# EAGLE design MiiChrono (EAGLE 7.7.0)

## Sheet 1 of 2
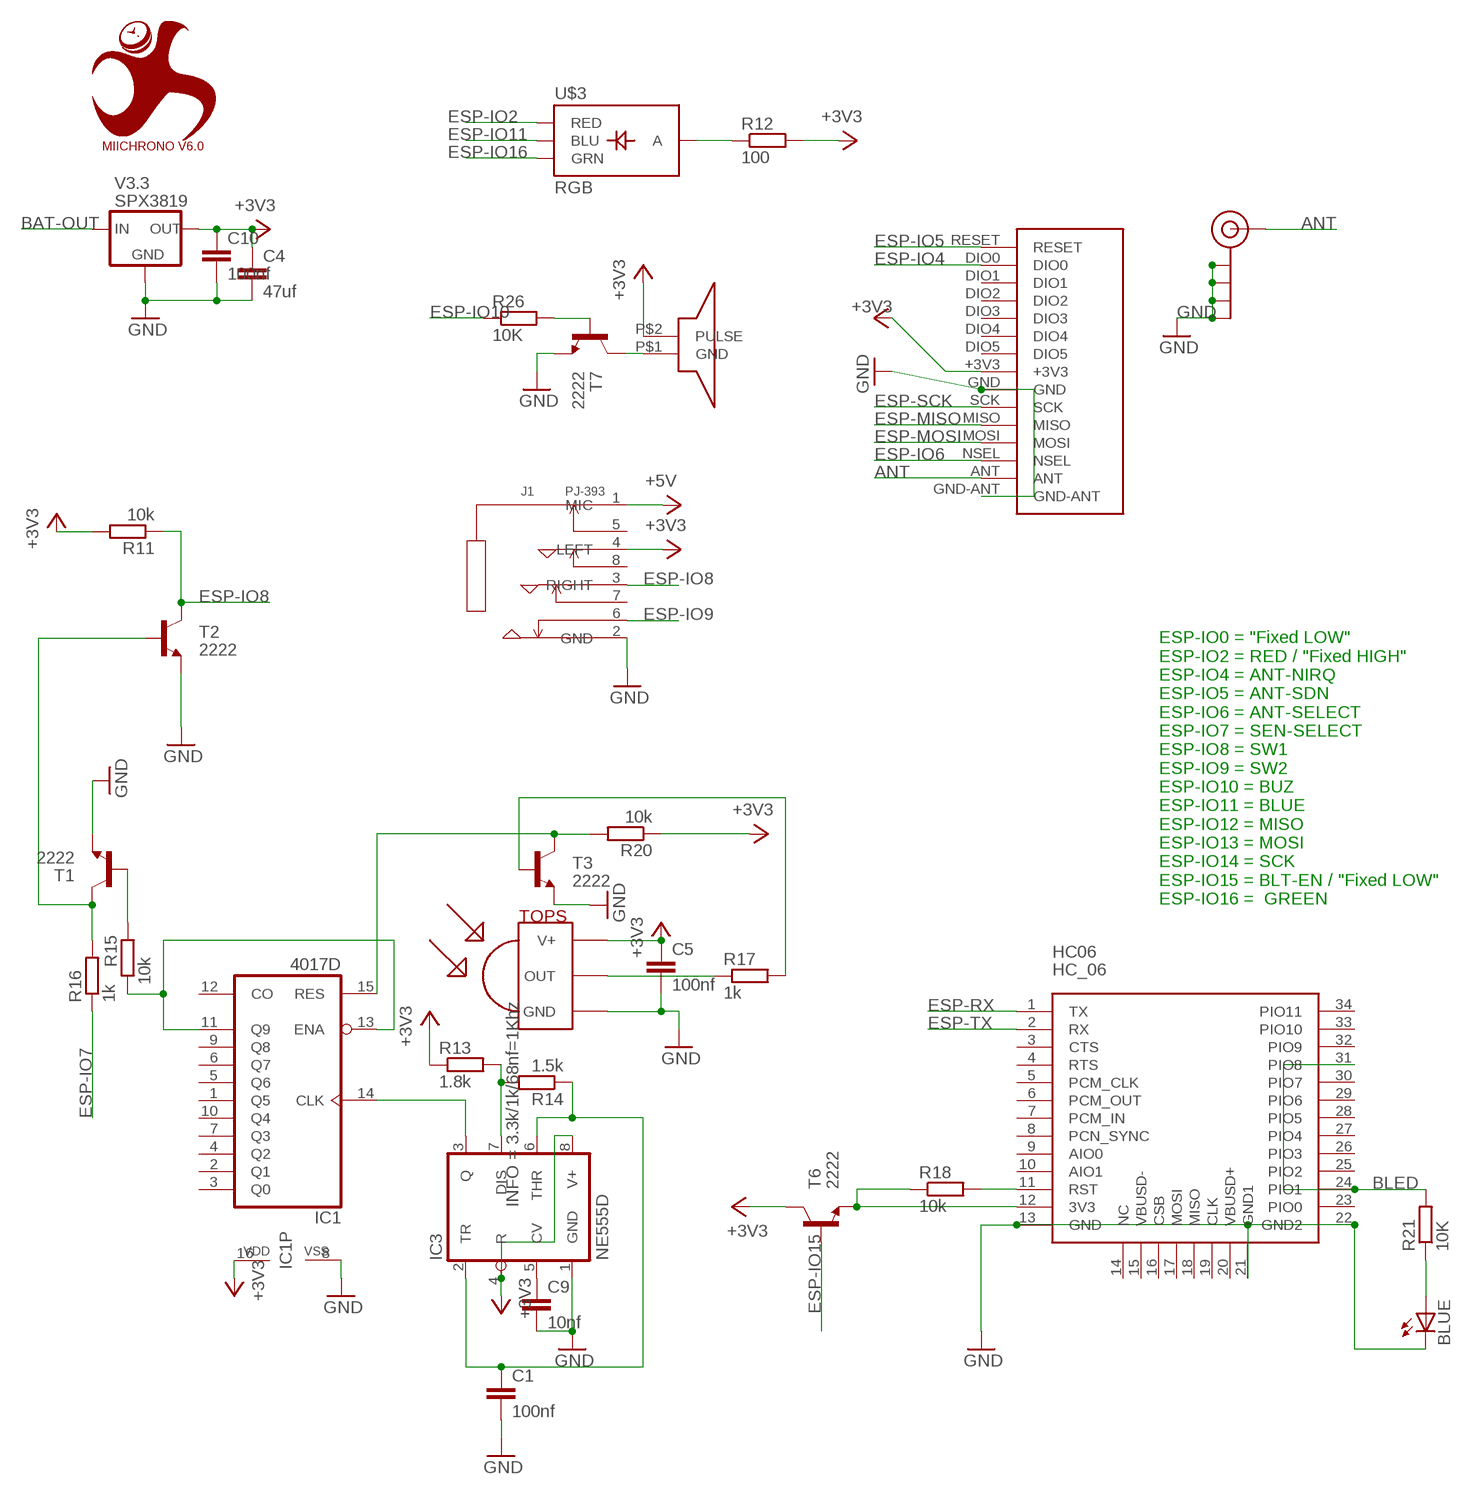
[diagram p0: schematic, sheet 1]

### Parts
BLUE  LEDCHIP-LED0805  [CHIP-LED0805]
BUZZER  BUZZER  [BUZZER]
C1  100nf  C-EUC0805  [C0805]
C4  47uf  C-EUC0805  [C0805]
C5  100nf  C-EUC0805  [C0805]
C9  10nf  C-EUC0805  [C0805]
C10  100nf  C-EUC0805  [C0805]
HC06  HC_06  HC_05  [BLUETOOTH_SMD]
IC1  4017D  [SO16]
IC3  NE555D  [SO08]
J1  PJ-393  AUDIO-JACK-PJ-393(8P-SMD)  [AUDIO8P-SMD-3.5-14.5X6.1X4.0MM]
J$1  SMA_EDGE  [SMA-EDGE]
R11  10k  R-EU_R0805  [R0805]
R12  100  R-EU_R0805  [R0805]
R13  1.8k  R-EU_R0805  [R0805]
R14  1.5k  R-EU_R0805  [R0805]
R15  10k  R-EU_R0805  [R0805]
R16  1k  R-EU_R0805  [R0805]
R17  1k  R-EU_R0805  [R0805]
R18  10k  R-EU_R0805  [R0805]
R20  10k  R-EU_R0805  [R0805]
R21  10K  R-EU_R0805  [R0805]
R26  10K  R-EU_R0805  [R0805]
T1  2222  TRANSISTOR_NPNSOT23  [SOT23]
T2  2222  TRANSISTOR_NPNSOT23  [SOT23]
T3  2222  TRANSISTOR_NPNSOT23  [SOT23]
T6  2222  TRANSISTOR_NPNSOT23  [SOT23]
T7  2222  TRANSISTOR_NPNSOT23  [SOT23]
TOPS  TSOP4838  [TSOP18XX]
U$1  MIICHRONO V6.0  MIICHRONO  [MIICHRONO]
U$2  DRF1278F  [DRF1278F]
U$3  RGB  LED-TRICOLOR  [LED-TRICOLOR-SMD]
V3.3  SPX3819  [SOT23-5]

### Nets
+3V3 [supply]: BUZZER.P$2(PULSE) C4.1 C5.1 C10.1 IC1.16(VDD) IC3.4(R) IC3.8(V+) J1.4(LEFT) R11.2 R12.2 R13.1 R20.1 T6.3(C) TOPS.VCC(V+) U$2.+3V3 V3.3.5(OUT)
+5V [supply]: J1.1(MIC) ; also sheet 2
ANT [antenna]: J$1.$P1(SIGNAL) U$2.ANT
BAT-OUT [supply]: V3.3.1(IN) V3.3.3(IN) ; also sheet 2
BLED: HC06.24(PIO1) HC06.31(PIO8) R21.2
ESP-IO2: U$3.R(RED) ; also sheet 2
ESP-IO4: U$2.DIO0 ; also sheet 2
ESP-IO5: U$2.RESET ; also sheet 2
ESP-IO6: U$2.NSEL ; also sheet 2
ESP-IO7: R16.1 ; also sheet 2
ESP-IO8: J1.3(RIGHT) R11.1 T2.3(C) ; also sheet 2
ESP-IO9: J1.6 ; also sheet 2
ESP-IO10: R26.1 ; also sheet 2
ESP-IO11: U$3.B(BLU) ; also sheet 2
ESP-IO15: T6.1(B) ; also sheet 2
ESP-IO16: U$3.G(GRN) ; also sheet 2
ESP-MISO: U$2.MISO ; also sheet 2
ESP-MOSI: U$2.MOSI ; also sheet 2
ESP-RX: HC06.1(TX) ; also sheet 2
ESP-SCK: U$2.SCK ; also sheet 2
ESP-TX: HC06.2(RX) ; also sheet 2
GND [supply]: BLUE.C C1.2 C4.2 C5.2 C9.2 C10.2 HC06.13(GND) HC06.21(GND1) HC06.22(GND2) IC1.8(VSS) IC3.1(GND) J1.2(GND) J$1.GND@0(GND) J$1.GND@1(GND) J$1.GND@2(GND) J$1.GND@3(GND) T1.2(E) T2.2(E) T3.2(E) T7.2(E) TOPS.GND U$2.GND U$2.GND-ANT V3.3.2(GND) ; also sheet 2
N$1: R17.2 T3.1(B)
N$2: C9.1 IC3.5(CV)
N$4: R16.2 T1.3(C) T2.1(B)
N$5: IC1.11(Q9) IC1.13(ENA) R15.1
N$7 [supply]: HC06.12(3V3) R18.1 T6.2(E)
N$10: R15.2 T1.1(B)
N$13: R12.1 U$3.A
N$14: C1.1 IC3.2(TR) IC3.6(THR) R14.1
N$15: HC06.11(RST) R18.2
N$16: IC1.14(CLK) IC3.3(Q)
N$17: IC3.7(DIS) R13.2 R14.2
N$20: R17.1 TOPS.OUT
N$22: BLUE.A R21.1
N$23: IC1.15(RES) R20.2 T3.3(C)
N$33: R26.2 T7.1(B)
N$34: BUZZER.P$1(GND) T7.3(C)
Unconnected: HC06.3(CTS) HC06.4(RTS) HC06.5(PCM_CLK) HC06.6(PCM_OUT) HC06.7(PCM_IN) HC06.8(PCN_SYNC) HC06.9(AIO0) HC06.10(AIO1) HC06.14(NC) HC06.15(VBUSD-) HC06.16(CSB) HC06.17(MOSI) HC06.18(MISO) HC06.19(CLK) HC06.20(VBUSD+) HC06.23(PIO0) HC06.25(PIO2) HC06.26(PIO3) HC06.27(PIO4) HC06.28(PIO5) HC06.29(PIO6) HC06.30(PIO7) HC06.32(PIO9) HC06.33(PIO10) HC06.34(PIO11) IC1.1(Q5) IC1.2(Q1) IC1.3(Q0) IC1.4(Q2) IC1.5(Q6) IC1.6(Q7) IC1.7(Q3) IC1.9(Q8) IC1.10(Q4) IC1.12(CO) J1.5 J1.7 J1.8 U$2.DIO1 U$2.DIO2 U$2.DIO3 U$2.DIO4 U$2.DIO5

### Notes on the sheet
- ESP-IO0 = "Fixed LOW"
  ESP-IO2 = RED / "Fixed HIGH"
  ESP-IO4 = ANT-NIRQ
  ESP-IO5 = ANT-SDN
  ESP-IO6 = ANT-SELECT
  ESP-IO7 = SEN-SELECT
  ESP-IO8 = SW1
  ESP-IO9 = SW2
  ESP-IO10 = BUZ
  ESP-IO11 = BLUE
  ESP-IO12 = MISO
  ESP-IO13 = MOSI
  ESP-IO14 = SCK
  ESP-IO15 = BLT-EN / "Fixed LOW"
  ESP-IO16 =  GREEN

## Sheet 2 of 2: ESP - 8285
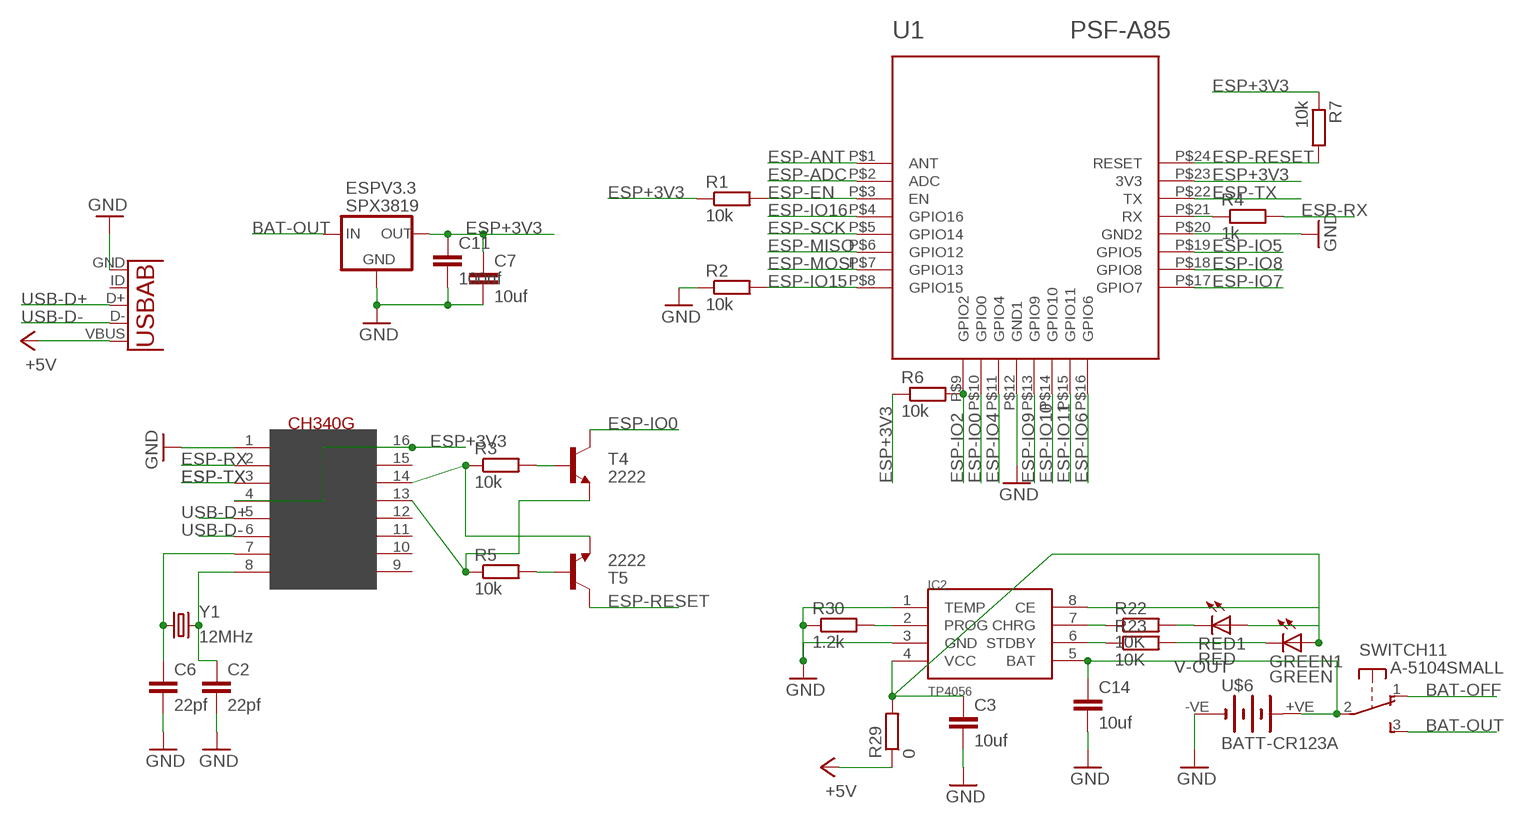
[diagram p1: schematic, sheet 2]

### Parts
C2  22pf  C-EUC0805  [C0805]
C3  10uf  C-EUC0805  [C0805]
C6  22pf  C-EUC0805  [C0805]
C7  10uf  C-EUC0805  [C0805]
C11  100nf  C-EUC0805  [C0805]
C14  10uf  C-EUC0805  [C0805]
ESPV3.3  SPX3819  [SOT23-5]
GREEN1  GREEN  LEDCHIP-LED0805  [CHIP-LED0805]
IC2  TP4056  [SOP-8]
ISP2  USB-ABUSB_SIERK  [USB_AB_MICRO_SJH]
R1  10k  R-EU_R0805  [R0805]
R2  10k  R-EU_R0805  [R0805]
R3  10k  R-EU_R0805  [R0805]
R4  1k  R-EU_R0805  [R0805]
R5  10k  R-EU_R0805  [R0805]
R6  10k  R-EU_R0805  [R0805]
R7  10k  R-EU_R0805  [R0805]
R22  10K  R-EU_R0805  [R0805]
R23  10K  R-EU_R0805  [R0805]
R29  0  R-EU_R0805  [R0805]
R30  1.2k  R-EU_R0805  [R0805]
RED1  RED  LEDCHIP-LED0805  [CHIP-LED0805]
SWITCH1  A-5104SMALL  [A-5104-SMALL]
T4  2222  TRANSISTOR_NPNSOT23  [SOT23]
T5  2222  TRANSISTOR_NPNSOT23  [SOT23]
U1  PSF-A85  [PSF-A85]
U$5  CH340G  [SOIC16]
U$6  BATT-CR123A  [KEYSTONE-2/3A]
Y1  12MHz  CRYSTAL5X3  [CRYSTAL-SMD-5X3]

### Nets
+5V [supply]: ISP2.VBUS R29.1 ; also sheet 1
BAT-OFF [supply]: SWITCH1.1(1:O)
BAT-OUT [supply]: ESPV3.3.1(IN) ESPV3.3.3(IN) SWITCH1.3(1:S) ; also sheet 1
ESP+3V3 [supply]: C7.1 C11.1 ESPV3.3.5(OUT) R1.1 R6.1 R7.1 U1.P$23(3V3) U$5.4(V3) U$5.16(VCC)
ESP-ADC: U1.P$2(ADC)
ESP-ANT: U1.P$1(ANT)
ESP-EN: R1.2 U1.P$3(EN)
ESP-IO0: T4.3(C) U1.P$10(GPIO0)
ESP-IO2: R6.2 U1.P$9(GPIO2) ; also sheet 1
ESP-IO4: U1.P$11(GPIO4) ; also sheet 1
ESP-IO5: U1.P$19(GPIO5) ; also sheet 1
ESP-IO6: U1.P$16(GPIO6) ; also sheet 1
ESP-IO7: U1.P$17(GPIO7) ; also sheet 1
ESP-IO8: U1.P$18(GPIO8) ; also sheet 1
ESP-IO9: U1.P$13(GPIO9) ; also sheet 1
ESP-IO10: U1.P$14(GPIO10) ; also sheet 1
ESP-IO11: U1.P$15(GPIO11) ; also sheet 1
ESP-IO15: R2.2 U1.P$8(GPIO15) ; also sheet 1
ESP-IO16: U1.P$4(GPIO16) ; also sheet 1
ESP-MISO: U1.P$6(GPIO12) ; also sheet 1
ESP-MOSI: U1.P$7(GPIO13) ; also sheet 1
ESP-RESET: R7.2 T5.3(C) U1.P$24(RESET)
ESP-RX: R4.2 U$5.2(TX) ; also sheet 1
ESP-SCK: U1.P$5(GPIO14) ; also sheet 1
ESP-TX: U1.P$22(TX) U$5.3(RX) ; also sheet 1
GND [supply]: C2.2 C3.2 C6.2 C7.2 C11.2 C14.2 ESPV3.3.2(GND) IC2.1(TEMP) IC2.3(GND) ISP2.GND R2.1 R30.1 U1.P$12(GND1) U1.P$20(GND2) U$5.1(GND) U$6.-VE(-) ; also sheet 1
N$3: C6.1 U$5.7(XI) Y1.1
N$6: C2.1 U$5.8(XO) Y1.3
N$8: R3.1 T5.2(E) U$5.14(RTS)
N$9: R5.1 T4.2(E) U$5.13(DTR)
N$24: R5.2 T5.1(B)
N$25: R3.2 T4.1(B)
N$26: R4.1 U1.P$21(RX)
N$27: GREEN1.C R23.2
N$28: R22.2 RED1.C
N$29: IC2.7(CHRG) R22.1
N$30: IC2.6(STDBY) R23.1
N$31: IC2.2(PROG) R30.2
USB-D+: ISP2.D+ U$5.5(D+)
USB-D-: ISP2.D- U$5.6(D-)
V-IN: C3.1 GREEN1.A IC2.4(VCC) IC2.8(CE) R29.2 RED1.A
V-OUT: C14.1 IC2.5(BAT) SWITCH1.2(1:P) U$6.+VE(+)
Unconnected: ISP2.ID(USBID) SWITCH1.MT1(MT) SWITCH1.MT2(MT) U$5.9(CTS) U$5.10(DSR) U$5.11(RI) U$5.12(DCD) U$5.15(RS232)

## Library data of the parts
BLUE GREEN1 RED1 = adafruit:LED: LED OSRAM: - CHIPLED LG R971, LG N971, LY N971, LG Q971, LY Q971, LO R971, LY R971 LH N974, LH R974 LS Q976, LO Q976, LY Q976 LO Q996 - Hyper CHIPLED LW Q18S LB Q993, LB Q99A, LB R99A - SideLED LS A670, LO A670, LY A670, LG A670, LP A670 LB A673, LV A673, LT A673, LW A673 LH A674 LY A675 LS A676, LA A676, LO A676, LY A676, LW A676 LS A679, LY A679, LG A679 - Hyper Micro SIDELED® LS Y876, LA Y876, LO Y876, LY Y876 LT Y87S - SmartLED LW L88C, LW L88S LB L89C, LB L89S, LG L890 LS L89K, LO L89K, LY L89K LS L896, LA L896, LO L896, LY L896 - TOPLED LS T670, LO T670, LY T670, LG T670, LP T670 LSG T670, LSP T670, LSY T670, LOP T670, LYG T670 LG T671, LOG T671, LSG T671 LB T673, LV T673, LT T673, LW T673 LH T674 LS T676, LA T676, LO T676, LY T676, LB T676, LH T676, LSB T676, LW T676 LB T67C, LV T67C, LT T67C, LS T67K, LO T67K, LY T67K, LW E67C LS E67B, LA E67B, LO E67B, LY E67B, LB E67C, LV E67C, LT E67C LW T67C LS T679, LY T679, LG T679 LS T770, LO T770, LY T770, LG T770, LP T770 LB T773, LV T773, LT T773, LW T773 LH T774 LS E675, LA E675, LY E675, LS T675 LS T776, LA T776, LO T776, LY T776, LB T776 LHGB T686 LT T68C, LB T68C - Hyper Mini TOPLED® LB M676 - Mini TOPLED Santana® LG M470 LS M47K, LO M47K, LY M47K Source: http://www.osram.convergy.de/
BUZZER = MyLib:BUZZER
C1-C7 C9-C11 C14 = rcl:C-EU: CAPACITOR, European symbol
ESPV3.3 V3.3 = PMIC:SPX3819
HC06 = SerialPortBluetooth:HC_05
IC1 = 40xx:4017: COUNTER/DIVIDER
IC2 = TP4056:TP4056
IC3 = adafruit:*555: TIMER Changed DIP package to have round (not oval) pin pads http://www.ladyada.net/library/pcb/eaglelibrary.html; INFO: 3.3k/1k/68nf=1Khz
ISP2 = MyLib:USB-AB: This is a USB AB connector that is compatible with USB OTG. i.e. this connector can serve as a host or device
J1 = MyLib:AUDIO-JACK-PJ-393(8P-SMD): 320040009; MPN: PJ-393
J$1 = MyLib:SMA_EDGE: SMA Antenna Connector End launch SMA connector. The paste layer has been removed so that the connector can be hand soldered onto the board after reflow.
R1-R7 R12 = rcl:R-EU_: RESISTOR, European symbol; NOTE: WAS 68
R11 R13-R18 R20 = rcl:R-EU_: RESISTOR, European symbol
R21-R23 R26 R29 R30 = rcl:R-EU_: RESISTOR, European symbol; NOTE: WAS 120
SWITCH1 = MyLib:A-5104: E-Switch right-angle slide SPDT Ebay and taydaElectronics A-5014
T1-T7 = SparkFun:TRANSISTOR_NPN: Transistor NPN BJT configuration in SOT23 package. MMBT2222 is the common NPN we use. Double check BCE configuration again layout.
TOPS = tsop:TSOP4838: IR Receiver and Demodulator
U1 = ITEAD:PSF-A85
U$1 = MyLib:MIICHRONO
U$2 = MyLib:DRF1278F
U$3 = MyLib:LED-TRICOLOR: Tri-Color LED SMD Proven layout and schematic for triple color LED in SMD package - common anode. Spark Fun Electronics SKU : COM-07844
U$5 = usb-serial:CH340G
U$6 = eagle-library-edeca:BATT-CR123A: CR123A (2/3rd AA) battery holder Manufacturer: Keystone Mouser part: 534-1019
Y1 = SparkFun:CRYSTAL: Crystals Various standard crystals. Proven footprints. Spark Fun Electronics SKU : COM-00534

## Net classes
0 default: width 0.203 mm
1 supply: width 0.254 mm
2 antenna: width 0.381 mm, clearance 0.203 mm

## Board
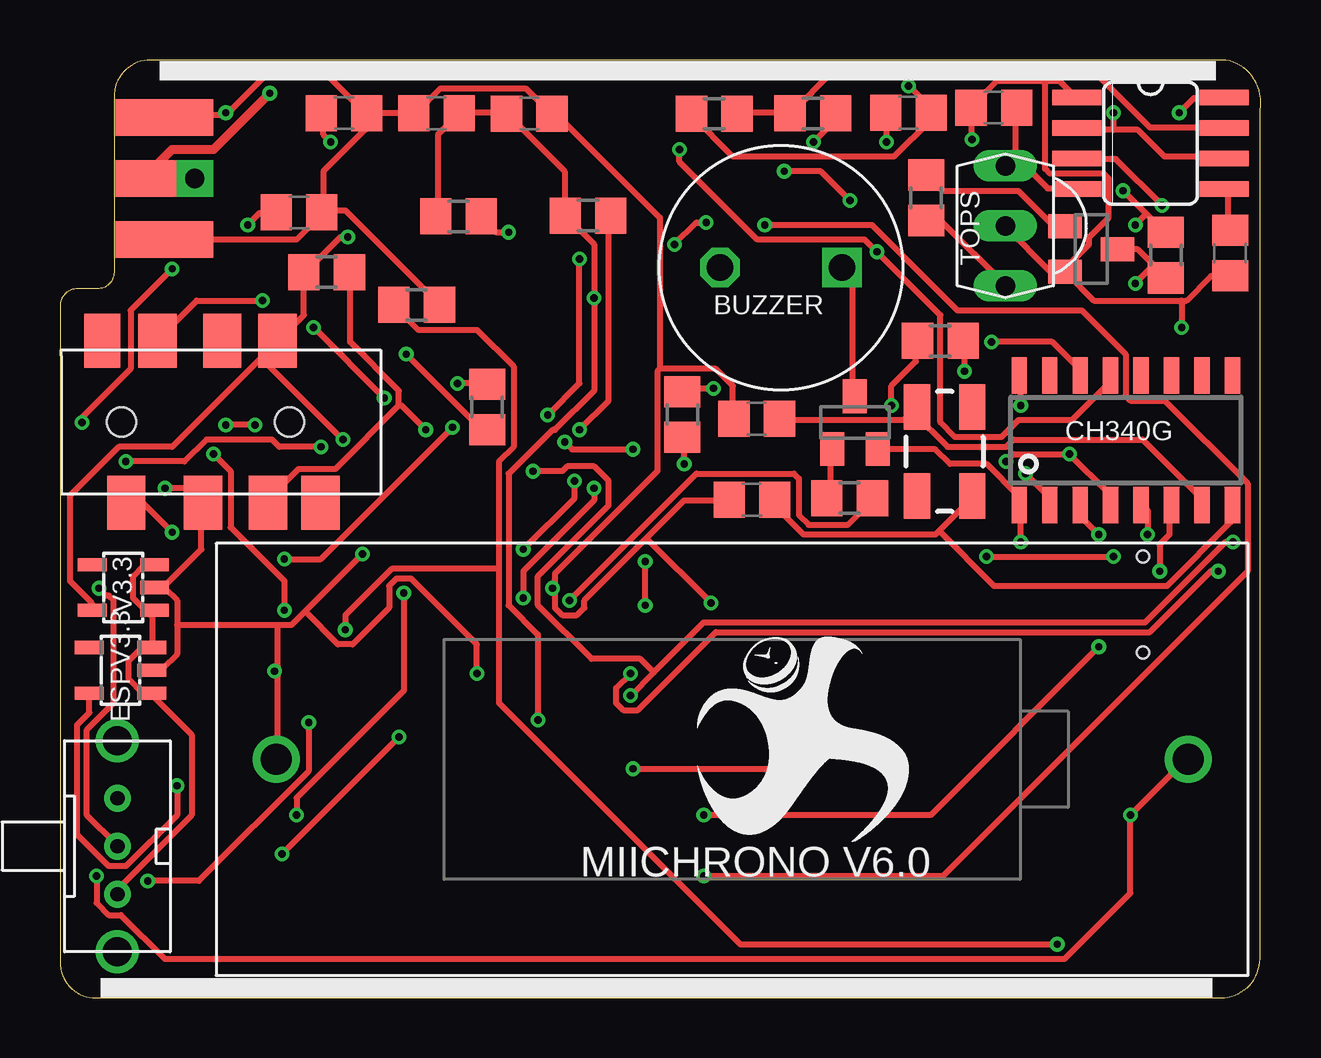
[diagram p2: board, top side]
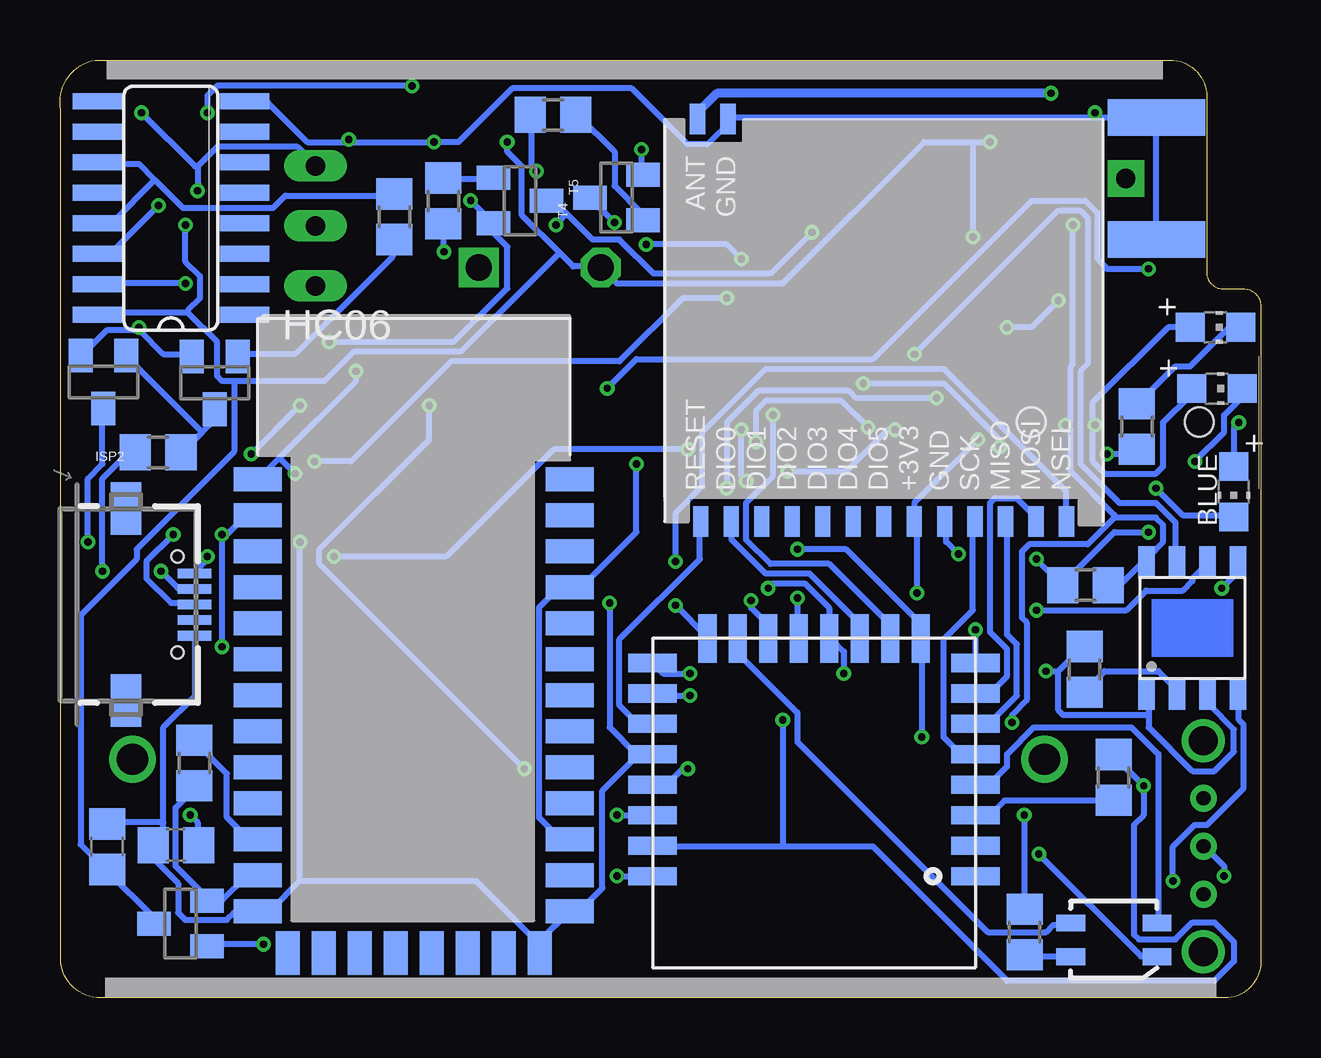
[diagram p3: board, bottom side, seen from below]

Size 50.03 x 39.08 mm. Coordinates in mm from the lower left corner, seen from the top.
Outline: 1.5,0 48.35,0 arc90 50,1.65 50,37 arc90 48.57,39.08 3.78,39.08 arc90 2.25,37.55 2.25,30.22 arc-90 1.58,29.55 0.72,29.55 arc90 0,28.82 0,1.5 arc90 1.5,0
Copper layers (1*16): Top 0.035mm / dielectric 1.5mm / Bottom 0.035mm
Design rules "SierkSeed *": minimum track width 10mil, minimum drill 12mil, track to track 6mil, track to pad 6mil, pad to pad 6mil, via to via 6mil, smd to smd 0mil, copper to edge 10mil, drill to drill 10mil, minimum pad ring 10mil, minimum via ring 6mil, stop-mask expansion 2mil, vias tented up to drill 100mil, thermal gap 10mil

### Footprints (pad centres in the part's own frame; a part is rotated, then mirrored left to right if it is on the bottom)
CHIP-LED0805 = smd 1.2 x 1.2: A 0,-1.05; C 0,1.05
BUZZER = drill 1.1 square: P$1 0,0 | drill 1.1 octagon: P$2 5.08,0
C0805 = smd 1.3 x 1.5: 1 -0.95,0; 2 0.95,0
SOT23-5 = smd 1.2 x 0.55: 1 1.3,-0.95; 2 1.3,0; 3 1.3,0.95; 4 -1.3,0.95; 5 -1.3,-0.95
BLUETOOTH_SMD = smd 2 x 1: 1 0,0; 2 0,-1.5; 3 0,-3; 4 0,-4.5; 5 0,-6; 6 0,-7.5; 7 0,-9; 8 0,-10.5; 9 0,-12; 10 0,-13.5; 11 0,-15; 12 0,-16.5; 13 0,-18; 22 13,-18; 23 13,-16.5; 24 13,-15; 25 13,-13.5; 26 13,-12; 27 13,-10.5; 28 13,-9; 29 13,-7.5; 30 13,-6; 31 13,-4.5; 32 13,-3; 33 13,-1.5; 34 13,0 | smd 1 x 1.8: 14 1.25,-19.75; 15 2.75,-19.75; 16 4.25,-19.75; 17 5.75,-19.75; 18 7.25,-19.75; 19 8.75,-19.75; 20 10.25,-19.75; 21 11.75,-19.75
SO16 = smd 0.66 x 2.032: 1 -4.445,-3.073; 2 -3.175,-3.073; 3 -1.905,-3.073; 4 -0.635,-3.073; 5 0.635,-3.073; 6 1.905,-3.073; 7 3.175,-3.073; 8 4.445,-3.073; 9 4.445,3.073; 10 3.175,3.073; 11 1.905,3.073; 12 0.635,3.073; 13 -0.635,3.073; 14 -1.905,3.073; 15 -3.175,3.073; 16 -4.445,3.073
SOP-8 = smd 1.3 x 0.7: 1 -2.75,1.905; 2 -2.75,0.635; 3 -2.75,-0.635; 4 -2.75,-1.905; 5 2.75,-1.905; 6 2.75,-0.635; 7 2.75,0.635; 8 2.75,1.905
SO08 = smd 0.66 x 2.032: 1 -1.905,-3.073; 2 -0.635,-3.073; 3 0.635,-3.073; 4 1.905,-3.073; 5 1.905,3.073; 6 0.635,3.073; 7 -0.635,3.073; 8 -1.905,3.073
USB_AB_MICRO_SJH = smd 1.4 x 0.4: D+ 2.85,0; D- 2.85,0.65; GND 2.85,-1.3; ID 2.85,-0.65; VBUS 2.85,1.3 | smd 1.27 x 2.2: P$8 0,4; P$9 0,-4 | hole 0.5: 2.15,2; 2.15,-2
AUDIO8P-SMD-3.5-14.5X6.1X4.0MM = smd 1.6 x 2.25: 1 3.9,-3.375; 2 7.1,-3.375; 3 9.8,-3.375; 4 10.2,3.375; 6 5.2,3.375; 7 7.9,3.375; 8 12,-3.375 | smd 1.5 x 2.25: 5 2.9,3.375 | hole 1.2: 3.7,0; 10.7,0
SMA-EDGE = smd 1.524 x 2.54: $P1 2.54,0.762 | smd 1.524 x 4.064: GND@0 0,0; GND@1 5.08,0 | smd 1.524 x 4.064 bottom: GND@2 0,0; GND@3 5.08,0 | drill 0.8 pad 1.524 square: SIG 2.54,-1.27
R0805 = smd 1.3 x 1.5: 1 -0.95,0; 2 0.95,0
A-5104-SMALL = drill 0.6: 1 -2,0; 2 0,0; 3 2,0 | drill 1.2: MT1 -4.4,0; MT2 4.4,0
SOT23 = smd 1 x 1.4: 1 -0.95,-1.1; 2 0.95,-1.1; 3 0,1.1
TSOP18XX = drill 0.813 long: GND -0.001,-0.027; OUT -2.501,-0.027; VCC 2.499,-0.027
PSF-A85 = smd 0.762 x 2.032: P$1 3.81,0; P$2 5.08,0; P$3 6.35,0; P$4 7.62,0; P$5 8.89,0; P$6 10.16,0; P$7 11.43,0; P$8 12.7,0; P$17 12.7,13.462; P$18 11.43,13.462; P$19 10.16,13.462; P$20 8.89,13.462; P$21 7.62,13.462; P$22 6.35,13.462; P$23 5.08,13.462; P$24 3.81,13.462 | smd 2.032 x 0.762: P$9 13.716,2.286; P$10 13.716,3.556; P$11 13.716,4.826; P$12 13.716,6.096; P$13 13.716,7.366; P$14 13.716,8.636; P$15 13.716,9.906; P$16 13.716,11.176
DRF1278F = smd 0.635 x 1.27: +3V3 0.24,-7.62; ANT -8.79,9.144; DIO0 -7.38,-7.62; DIO1 -6.11,-7.62; DIO2 -4.84,-7.62; DIO3 -3.57,-7.62; DIO4 -2.3,-7.62; DIO5 -1.03,-7.62; GND 1.51,-7.62; GND-ANT -7.52,9.144; MISO 4.05,-7.62; MOSI 5.32,-7.62; NSEL 6.59,-7.62; RESET -8.65,-7.62; SCK 2.78,-7.62
LED-TRICOLOR-SMD = smd 0.7 x 1.2: A 0.7,-1.8; B -0.7,-1.8; G -0.7,1.8; R 0.7,1.8
SOIC16 = smd 0.635 x 1.524: 1 -4.445,-2.695; 2 -3.175,-2.695; 3 -1.905,-2.695; 4 -0.635,-2.695; 5 0.635,-2.695; 6 1.905,-2.695; 7 3.175,-2.695; 8 4.445,-2.695; 9 4.445,2.695; 10 3.175,2.695; 11 1.905,2.695; 12 0.635,2.695; 13 -0.635,2.695; 14 -1.905,2.695; 15 -3.175,2.695; 16 -4.445,2.695
KEYSTONE-2/3A = drill 1.3: +VE 0,19; -VE 0,-19
CRYSTAL-SMD-5X3 = smd 1.9 x 1.1: 1 -1.85,-1.15; 2 1.85,-1.15; 3 1.85,1.15; 4 -1.85,1.15

### Placement (x,y rotation side)
BLUE  1.12,21.09 180 bottom
BUZZER  32.58,30.43 180 top
C1  35.35,36.88 180 top
C2  28.83,20.76 180 top
C3  9.96,32.73 0 top
C4  48.07,6.3 90 bottom
C5  38.91,37.1 180 top
C6  29.03,24.13 180 top
C7  19.55,36.85 0 top
C9  48.75,31.04 270 top
C10  11.83,36.87 0 top
C11  15.69,36.86 180 top
C14  45.2,6.37 180 bottom
ESPV3.3  2.52,13.65 0 top
GREEN1  1.88,27.94 270 bottom
HC06  41.78,21.62 0 bottom
IC1  45.41,32.91 90 bottom
IC2  2.85,15.41 90 bottom
IC3  45.44,35.61 270 top
ISP2  47.28,16.39 0 bottom
J1  -1.14,24 0 top
J$1  4.35,31.6 90 top
R1  6.13,9.19 270 bottom
R2  14.86,28.88 180 top
R3  29.49,36.79 0 bottom
R4  36.68,27.38 0 top
R5  34.06,33.21 90 bottom
R6  22,32.6 0 top
R7  16.6,32.56 0 top
R11  11.11,30.24 180 top
R12  9.84,2.75 90 bottom
R13  31.37,36.86 180 top
R14  27.26,36.84 0 top
R15  36.1,32.55 270 bottom
R16  45.94,22.73 0 bottom
R17  36.09,33.34 90 top
R18  44.43,9.79 90 bottom
R20  46.08,30.95 270 top
R21  25.93,24.31 270 top
R22  17.8,24.62 90 top
R23  5.16,23.81 90 bottom
R26  32.9,20.82 180 top
R29  7.3,17.2 0 bottom
R30  7.34,13.69 270 bottom
RED1  1.82,25.39 270 bottom
SWITCH1  2.39,6.32 270 top
T1  43.58,25.63 180 bottom
T2  48.22,25.66 180 bottom
T3  42.97,31.2 270 top
T4  26.84,33.35 90 bottom
T5  30.86,33.22 270 bottom
T6  45.01,3.1 90 bottom
T7  33.12,23.97 0 top
TOPS  39.36,32.17 90 top
U1  11.88,1.26 90 bottom
U$1  26.54,6.51 0 top
U$2  14.68,27.47 0 bottom
U$3  6.12,2.42 270 bottom
U$5  44.41,23.24 0 top
U$6  28.01,9.94 270 top
V3.3  2.64,17.1 0 top
Y1  36.86,22.77 270 top

### Tracks (layer width: path | path; a pad name or v marks a point on that pad's centre or on a via)
+3V3  (via drill 0.3)
  Top 0.254: V3.3.5 1.32,16.15 1.32,16.46 0.41,17.37 0.41,20.93 2.44,22.96 4.67,22.96 9.04,27.33 J1.4 | v11.79,23.27 8.43,26.62 J1.4 | v9.86,7.62 9.86,8.33 14.33,12.8 v14.33,16.87 | J1.4 9.14,27.43 10.16,28.45 R11.2 10.26,30.28 11.68,31.7 v11.99,31.7 | v44.3,33.63 45.26,32.66 | 45.26,32.66 46.02,31.9 R20.1 | C5.1 39.83,37.08 39.83,35.15 39.42,34.75 TOPS.VCC 39.83,35.05 41.15,33.73 42.27,33.73 IC3.4 | v46.63,36.88 47.24,37.49 48.46,37.49 IC3.8 | v31.39,35.66 32.31,36.58 32.31,36.78 R13.1 | v11.28,35.66 10.97,35.97 10.97,36.78 C10.1 | v44.81,32.21 45.26,32.66
  Bottom 0.254: v11.79,23.27 14.43,20.62 14.43,19.91 U$2.+3V3 14.33,19.81 v14.33,16.87 | v9.86,7.62 9.86,3.76 R12.2 | 44.3,34.65 v44.3,33.63 | 44.3,34.65 43.48,35.46 40.13,35.46 39.42,34.75 TOPS.VCC | v46.63,36.88 44.4,34.65 44.3,34.65 | T6.3 46.13,3.15 46.13,3.35 48.06,5.28 C4.1 48.16,5.38 49.17,6.4 49.17,15.95 46.84,18.29 46.84,18.69 42.77,22.76 42.77,25.7 | v31.39,35.66 31.39,35.26 30.79,34.65 30.79,32.61 29.21,31.04 | 29.21,31.04 28.65,30.48 27.53,30.48 BUZZER.P$2 27.43,30.38 26.82,29.77 19.91,29.77 14.02,35.66 11.99,35.66 | 11.99,35.66 v11.28,35.66 | 44.7,28.55 48.46,28.55 IC1.16 | 44.7,28.55 43.48,27.33 43.48,25.91 43.28,25.7 42.77,25.7 | 42.77,25.7 39.01,25.7 37.8,26.92 33.33,26.92 29.21,31.04 | v44.81,32.21 44.81,30.68 44.2,30.07 44.2,29.16 44.7,28.65 44.7,28.55 | 11.99,35.66 v11.99,31.7
+5V  (via drill 0.3)
  Top 0.254: v38.61,18.39 v43.89,18.39 | v23.88,22.86 21.34,22.86 v21.03,23.16 | v16.36,23.77 10.87,18.29 v9.35,18.29 | v4.67,19.41 3.45,20.62 2.85,20.62 J1.1
  Bottom 0.254: v43.89,18.39 43.89,18.29 44.4,17.78 ISP2.VBUS | v38.61,18.39 33.93,18.39 29.46,22.86 v23.88,22.86 | v21.03,23.16 21.03,24.49 20.62,24.89 17.48,24.89 v16.36,23.77 | v9.35,18.29 8.33,17.27 R29.1 8.23,17.27 6.1,19.41 v4.67,19.41
ANT  (via drill 0.3)
  Top 0.381: v8.74,37.69 6.4,35.36 4.67,35.36 3.56,34.24 J$1.$P1
  Bottom 0.381: v8.74,37.69 22.66,37.69 23.47,36.88 23.47,36.68 U$2.ANT
BAT-OUT
  Top 0.254: V3.3.3 3.86,17.98 3.45,17.98 3.05,17.58 3.05,16.66 3.76,15.95 V3.3.1 3.86,16.05 3.86,14.63 ESPV3.3.3 3.76,14.53 3.35,14.53 2.85,14.02 2.85,13.31 3.45,12.7 ESPV3.3.1 3.86,12.6 5.49,10.97 5.49,7.62 2.44,4.57 2.44,4.37 SWITCH1.3
BLED  (via drill 0.3)
  Top 0.254: v26.01,22.25 26.01,23.27 R21.2
  Bottom 0.254: v26.01,22.25 26.01,19.41 28.25,17.17 28.75,17.17 HC06.31 28.85,17.07 29.26,17.07 30.07,16.26 30.07,7.52 29.26,6.71 28.85,6.71 HC06.24
ESP+3V3  (via drill 0.3)
  Top 0.254: v4.88,8.84 4.88,7.62 2.74,5.49 2.03,5.49 0.71,6.81 0.71,11.38 1.22,11.89 ESPV3.3.5 | v40.03,24.69 40.03,25.91 U$5.16 | U$5.4 43.69,20.62 43.69,21.03 v42.06,22.66 39.73,22.66 v39.42,22.35 | R7.1 15.75,32.61 15.75,35.97 16.56,36.78 C11.1 16.76,36.88 18.49,36.88 C7.1 18.69,36.78 21.03,34.44 21.03,32.61 R6.1 21.13,32.51 22.25,31.39 v22.25,29.16 22.25,25.3 20.62,23.67 20.52,23.67 18.69,21.84 18.69,16.36 19.91,15.14 v19.91,11.58
  Bottom 0.254: R1.1 6.1,10.06 v4.88,8.84 4.88,7.62 5.28,7.21 5.28,2.64 5.08,2.44 3.56,2.44 2.85,3.15 1.93,3.15 1.12,2.34 1.12,1.52 1.93,0.71 10.57,0.71 16.15,6.3 19.91,6.3 | 19.91,6.3 25.3,6.3 U1.P$23 | v42.06,22.66 v40.03,24.69 | v39.42,22.35 37.9,22.35 33.73,26.52 26.72,26.52 24.08,29.16 v22.25,29.16 | v19.91,11.58 19.91,6.3
ESP-EN
  Bottom 0.254: R1.2 6.2,8.23 10.67,8.23 11.28,7.62 11.79,7.62 U1.P$3
ESP-IO0  (via drill 0.3)
  Top 0.254: v26.92,32.31 26.52,32.31 v25.6,31.39 | v21.64,30.79 21.64,25.6 v20.32,24.28
  Bottom 0.254: v26.92,32.31 27.94,33.33 T4.3 | v25.6,31.39 22.25,31.39 v21.64,30.79 | v20.32,24.28 20.32,21.74 21.44,20.62 21.44,19.1 20.42,18.09 17.98,18.09 15.44,15.54 15.44,15.04 U1.P$10
ESP-IO2  (via drill 0.3)
  Top 0.254: v14.12,10.87 v9.25,5.99 | v21.64,23.67 22.86,24.89 22.86,32.51 R6.2 | v21.44,21.54 21.44,20.83 v19.3,18.69
  Bottom 0.254: v9.25,5.99 4.98,1.73 4.37,1.73 U$3.R | v14.12,10.87 14.12,14.94 U1.P$9 14.22,15.04 14.22,15.65 17.27,18.69 v19.3,18.69 | v21.64,23.67 21.64,21.74 v21.44,21.54
ESP-IO4
  Bottom 0.254: U$2.DIO0 22.05,19.81 22.05,19.1 20.62,17.68 18.8,17.68 16.76,15.65 16.76,15.04 U1.P$11
ESP-IO5
  Bottom 0.254: U$2.RESET 23.37,19.81 23.37,18.29 26.72,14.94 26.72,12.19 26.01,11.48 25.4,11.48 U1.P$19
ESP-IO6  (via drill 0.3)
  Top 0.254: v24.38,16.36 v24.38,18.19
  Bottom 0.254: v24.38,18.19 24.38,20.22 23.27,21.34 23.27,23.57 20.62,26.21 13.21,26.21 8.13,21.13 8.13,19.91 U$2.NSEL | v24.38,16.36 23.06,15.04 U1.P$16
ESP-IO7  (via drill 0.3)
  Top 0.254: v48.26,17.78 47.95,17.78 45.41,15.24 27.33,15.24 24.08,11.99 23.47,11.99 23.16,12.29 23.16,12.9 v23.77,13.51
  Bottom 0.254: v48.26,17.78 48.26,21.64 47.24,22.66 46.94,22.66 R16.1 | v23.77,13.51 24.89,13.51 25.3,13.92 U1.P$17
ESP-IO8  (via drill 0.3)
  Top 0.254: 14.12,24.69 14.12,25.3 12.09,27.33 12.09,30.18 R11.1 | 14.12,24.69 11.48,22.05 9.96,22.05 8.64,20.73 J1.3 | v48.87,19 48.56,19 45.21,15.65 26.82,15.65 24.74,13.56 | v23.77,12.6 24.74,13.56 | v15.24,23.67 14.22,24.69 14.12,24.69 | v19.71,21.95 20.93,21.95 21.13,22.15 22.25,22.15 22.86,21.54 22.86,20.52 19.91,17.58 19.91,16.36 22.15,14.12 24.18,14.12 24.74,13.56
  Bottom 0.254: v48.87,19 48.87,21.64 48.26,22.25 48.26,24.49 T2.3 | v23.77,12.6 25.3,12.6 U1.P$18 | v15.24,23.67 15.54,23.67 17.27,21.95 v19.71,21.95
ESP-IO9  (via drill 0.3)
  Top 0.254: v19.3,16.66 19.3,17.78 22.25,20.73 v22.25,21.23 | v10.57,27.94 v13.51,24.99 | v8.43,29.06 5.69,29.06 4.06,27.43 J1.6
  Bottom 0.254: v19.3,16.66 19.3,15.04 U1.P$13 | v22.25,21.23 22.25,23.98 20.93,25.3 17.17,25.3 16.87,24.99 v13.51,24.99 | v10.57,27.94 9.55,27.94 v8.43,29.06
ESP-IO10  (via drill 0.3)
  Top 0.254: v21.23,16.56 26.52,21.84 30.58,21.84 30.79,21.64 30.79,20.12 31.19,19.71 32.82,19.71 33.83,20.73 R26.1
  Bottom 0.254: v21.23,16.56 21.23,16.26 20.52,15.54 20.52,15.04 U1.P$14
ESP-IO11
  Bottom 0.254: U$3.B 7.92,3.05 8.64,3.05 8.94,2.74 11.38,2.74 19.3,10.67 19.3,11.89 21.74,14.33 21.74,14.94 U1.P$15
ESP-IO15  (via drill 0.3)
  Top 0.254: v41.55,2.23 28.35,2.23 18.29,12.29 18.29,17.88 | 18.29,17.88 18.29,22.35 18.9,22.96 18.9,26.31 17.37,27.84 14.94,27.84 13.92,28.85 R2.2 | v11.89,15.34 11.89,15.95 13.82,17.88 18.29,17.88
  Bottom 0.254: v41.55,2.23 43.89,2.23 T6.1 | v11.89,15.34 11.89,14.02 U1.P$8
ESP-IO16
  Bottom 0.254: U$3.G 4.27,3.15 4.27,10.16 5.38,11.28 9.45,11.28 10.57,10.16 10.57,9.65 11.28,8.94 11.79,8.94 U1.P$4
ESP-MISO
  Bottom 0.254: U$2.MISO 10.57,19.81 10.57,15.14 10.16,14.73 10.16,12.6 11.28,11.48 11.79,11.48 U1.P$6
ESP-MOSI
  Bottom 0.254: U$2.MOSI 9.45,19.91 9.45,20.12 10.16,20.83 11.07,20.83 11.28,20.62 11.28,15.24 10.57,14.53 10.57,13.41 11.28,12.7 11.79,12.7 U1.P$7
ESP-RESET  (via drill 0.3)
  Top 0.254: v18.69,31.9 18.19,31.9 17.58,32.51 R7.2 | v26.82,5.08 36.78,5.08 49.48,17.78 49.48,21.44 46.02,24.89 44.6,24.89 44.4,25.09 44.4,26.82 42.57,28.65 37.39,28.65 33.83,32.21 v29.36,32.21
  Bottom 0.254: 28.91,32.66 27.84,31.6 26.72,31.6 25.3,30.18 20.42,30.18 v18.69,31.9 | 28.91,32.66 29.36,33.12 29.67,33.12 T5.3 | v26.82,5.08 25.4,5.08 U1.P$24 | 28.91,32.66 v29.36,32.21
ESP-RX  (via drill 0.3)
  Top 0.254: v37.69,26.11 37.69,27.33 R4.2 | v40.23,21.84 41.15,20.93 41.15,20.62 U$5.2
  Bottom 0.254: v37.69,26.11 37.69,25.7 40.89,22.5 | 40.89,22.5 41.76,21.64 HC06.1 | 40.89,22.5 v40.23,21.84
ESP-SCK
  Bottom 0.254: U$2.SCK 11.99,19.81 11.99,16.15 13.21,14.94 13.21,10.87 12.5,10.16 U1.P$5
ESP-TX  (via drill 0.3)
  Top 0.254: v43.28,19.3 42.57,20.02 42.57,20.52 U$5.3 | v26.82,7.62 36.27,7.62 v43.28,14.63
  Bottom 0.254: HC06.2 41.86,20.12 42.27,20.12 43.08,19.3 v43.28,19.3 v43.28,14.63 | v26.82,7.62 25.4,7.62 U1.P$22
GND  (via drill 0.3)
  Top 0.254: 41.05,38.2 41.66,38.2 42.27,37.59 IC3.1 | 41.05,38.2 39.01,38.2 38,37.19 C5.2 38,36.98 v38,35.76 | T3.2 41.86,30.28 41.25,30.28 39.42,32.11 TOPS.GND | 46.74,29.06 43.08,29.06 41.96,30.18 T3.2 | 46.74,29.06 46.94,29.06 47.95,30.07 48.67,30.07 C9.2 | 46.74,29.06 v46.74,27.94 | 41.05,38.2 41.05,34.54 41.25,34.34 43.48,34.34 43.69,34.14 43.69,32.51 42.88,31.7 42.88,31.39 41.86,30.38 T3.2 | v34.44,35.66 34.44,36.78 C1.2 | T7.2 34.14,22.86 36.47,22.86 37.08,22.25 38.61,22.25 39.93,20.93 39.93,20.62 U$5.1 40.03,20.52 v40.03,19 | v4.37,21.23 5.38,21.23 5.89,20.73 J1.2 5.89,20.52 5.89,18.69 4.37,17.17 V3.3.2 3.96,17.07 4.37,17.07 4.88,16.56 4.88,15.54 | 4.88,15.54 4.88,14.33 4.27,13.72 3.86,13.72 ESPV3.3.2 | 10.21,16.1 9.65,15.54 9.04,15.54 | 10.21,16.1 v12.6,18.49 | 4.88,15.54 9.04,15.54 | 9.04,15.54 9.04,13.61 | 9.04,13.61 9.04,9.96 U$6.-VE | v8.94,13.61 9.04,13.61 | 24.43,19.15 21.84,16.56 21.84,16.26 21.54,15.95 20.93,15.95 20.62,16.26 20.62,17.07 | 24.43,19.15 26.01,20.73 27.84,20.73 C2.2 | 20.62,17.07 20.62,17.68 24.89,21.95 24.89,26.11 24.99,26.21 | 24.99,26.21 27.33,26.21 28.04,25.5 28.04,24.18 C6.2 | v20.52,17.07 20.62,17.07 | C3.2 10.97,32.82 10.97,34.44 12.7,36.17 12.7,36.78 C10.2 | R2.1 15.75,28.96 11.89,32.82 11.07,32.82 C3.2 | C10.2 12.9,36.88 14.73,36.88 C11.2 14.83,36.88 15.85,37.9 19.41,37.9 20.42,36.88 C7.2 20.62,36.88 24.99,32.51 24.99,26.21 | J$1.GND@2 4.37,31.6 9.86,31.6 10.87,32.61 C3.2 | 6.91,36.78 4.37,36.78 J$1.GND@3 | 6.91,36.78 8.53,38.41 11.18,38.41 12.7,36.88 C10.2 | 10.21,16.1 11.58,14.73 12.19,14.73 13.72,16.26 13.72,17.17 14.02,17.48 14.63,17.48 17.37,14.73 v17.37,13.51
  Top 0.254: 24.43,19.15 v27.13,16.46 | v6.91,36.88 6.91,36.78
  Bottom 0.254: 46.74,27.84 45.72,26.82 44.6,26.82 T1.2 | 46.74,27.84 48.06,27.84 49.07,26.82 T2.2 | v46.74,27.94 46.74,27.84 | 38,35.66 39.73,35.66 41.35,37.29 42.27,37.29 IC1.8 | 38,35.66 v34.44,35.66 33.43,35.66 31.19,37.9 26.21,37.9 23.88,35.56 23.06,35.56 22.05,36.58 U$2.GND-ANT 22.15,36.68 6.91,36.68 | 6.91,36.68 4.37,36.68 J$1.GND@3 4.37,36.58 4.37,31.7 J$1.GND@2 | v38,35.76 38,35.66 | 45.72,7.32 45.72,6.81 46.13,6.4 C14.2 46.13,6.3 46.13,5.79 45.11,4.78 45.11,3.56 44.81,3.25 43.08,3.25 42.77,3.56 41.86,3.56 HC06.13 41.66,3.66 41.25,3.66 40.03,4.88 | 45.72,7.32 45.72,11.28 44.4,12.6 44.4,15.04 ISP2.GND | 45.72,7.32 48.06,7.32 C4.2 | 40.03,4.88 v40.03,19 | 40.03,4.88 32.72,4.88 30.28,2.44 30.07,2.44 HC06.21 29.97,1.93 29.97,2.44 28.85,3.56 HC06.22 28.65,3.66 28.35,3.66 27.43,4.57 27.43,8.64 26.01,10.06 25.4,10.06 U1.P$20 26.01,10.16 27.13,11.28 v27.13,16.46 | 4.67,11.79 4.67,12.6 IC2.1 | 4.67,11.79 4.67,11.28 2.85,9.45 1.93,9.45 1.12,10.26 1.12,11.18 2.13,12.19 2.13,12.6 IC2.3 | 8.43,13.61 7.42,14.63 R30.1 | 8.43,13.61 8.43,11.99 8.23,11.79 4.67,11.79 | v4.37,21.23 3.25,20.12 1.22,20.12 BLUE.C | v12.6,18.49 13.11,19 13.11,19.81 U$2.GND | v8.94,13.61 8.43,13.61 | v20.52,17.07 20.32,17.27 19,17.27 17.98,16.26 17.98,15.04 U1.P$12 17.88,14.94 17.37,14.43 v17.37,13.51 | v6.91,36.88 6.91,36.68
N$1
  Top 0.254: T3.1 41.86,32.21 41.35,32.21 39.93,33.63 36.78,33.63 36.17,34.24 R17.2
N$2
  Top 0.254: C9.1 48.67,32 48.67,33.53 48.56,33.63 IC3.5
N$3
  Top 0.254: C6.1 30.07,24.08 35.15,24.08 35.66,24.59 Y1.1 35.56,24.38 36.98,22.96 39.42,22.96 39.73,23.27 45.11,23.27 47.55,20.83 47.55,20.62 U$5.7
N$4
  Bottom 0.254: 44.09,23.57 44.91,22.76 R16.2 | 44.09,23.57 43.59,24.08 43.59,24.49 T1.3 | 44.09,23.57 47.24,26.72 T2.1
N$5
  Bottom 0.254: 46.08,34.09 46.74,34.75 48.46,34.75 IC1.11 | 46.08,34.09 44.91,32.92 41.15,32.92 40.64,33.43 36.17,33.43 R15.1 | 46.08,34.09 47.85,32.31 48.46,32.31 IC1.13
N$6
  Top 0.254: 36.63,19.46 38,20.83 Y1.3 | 36.63,19.46 36.47,19.3 30.99,19.3 29.87,20.42 29.87,20.73 C2.1 | 36.63,19.46 38.91,17.17 46.13,17.17 48.77,19.81 48.77,20.52 U$5.8
N$7
  Bottom 0.254: HC06.12 41.86,5.08 42.27,5.08 43.28,4.06 43.89,4.06 T6.2 43.89,4.17 45.21,5.49 45.21,7.92 44.5,8.64 44.5,8.84 R18.1
N$8  (via drill 0.3)
  Top 0.254: v38.81,27.33 41.35,27.33 42.47,26.21 42.47,26.01 U$5.14 | v30.18,34.44 31.7,34.44 v32.92,33.22
  Bottom 0.254: v38.81,27.33 33.63,27.33 31.39,29.57 31.39,31.29 31.9,31.8 31.9,32.21 T5.2 32,32.31 v32.92,33.22 | v30.18,34.44 30.38,34.65 30.38,36.78 R3.1
N$9  (via drill 0.3)
  Top 0.254: v25.81,35.36 25.81,34.85 29.06,31.6 33.53,31.6 v34.04,31.09 36.68,28.45 36.68,23.98 37.29,23.37 39.22,23.37 39.93,24.08 42.16,24.08 43.69,25.6 43.69,25.91 U$5.13
  Bottom 0.254: v25.81,35.36 25.81,34.34 T4.2 | v34.04,31.09 34.04,32.21 R5.1
N$10
  Bottom 0.254: T1.1 42.57,26.82 40.23,26.82 36.17,30.89 36.17,31.6 R15.2
N$13
  Bottom 0.254: U$3.A 9.75,1.73 R12.1
N$14  (via drill 0.3)
  Top 0.254: 43.89,36.17 44.91,36.17 46.02,35.05 48.46,35.05 IC3.6 | 43.89,36.17 42.37,36.17 IC3.2 | R14.1 26.31,36.78 28.04,35.05 34.75,35.05 36.27,36.58 36.27,36.78 C1.1 36.37,36.98 v35.36,38 | v43.89,36.88 43.89,36.17
  Bottom 0.254: v43.89,36.88 43.89,37.59 43.48,38 v35.36,38
N$15
  Bottom 0.254: R18.2 44.4,10.67 43.08,9.35 43.08,7.52 42.27,6.71 41.86,6.71 HC06.11
N$16  (via drill 0.3)
  Top 0.254: v45.92,33.02 43.99,34.95 42.37,34.95 IC3.3
  Bottom 0.254: v45.92,33.02 47.85,31.09 48.46,31.09 IC1.14
N$17
  Top 0.254: R14.2 28.25,36.88 30.38,36.88 R13.2 30.48,36.88 32.21,38.61 43.08,38.61 45.41,36.27 48.46,36.27 IC3.7
N$20
  Top 0.254: R17.1 36.17,32.31 36.78,32.31 39.32,29.77 TOPS.OUT
N$22  (via drill 0.3)
  Top 0.254: v0.91,23.98 0.91,24.18 2.95,26.21 2.95,28.65 v4.67,30.38 | v27.23,25.4 26.11,25.4 26.01,25.3 R21.1
  Bottom 0.254: v0.91,23.98 1.12,23.77 BLUE.A | v4.67,30.38 6.4,30.38 6.81,30.79 6.81,32.72 7.32,33.22 9.55,33.22 16.15,26.62 26.01,26.62 v27.23,25.4
N$23  (via drill 0.3)
  Top 0.254: T3.3 44.09,31.19 44.91,31.19 46.02,30.07 R20.2 45.52,30.48 v44.81,29.77
  Bottom 0.254: v44.81,29.77 48.46,29.77 IC1.15
N$24
  Bottom 0.254: T5.1 32,34.14 34.04,34.14 R5.2
N$25
  Bottom 0.254: T4.1 25.81,32.41 25.81,32.72 26.92,33.83 26.92,35.26 28.45,36.78 R3.2
N$26  (via drill 0.3)
  Top 0.254: v34.65,24.69 34.65,25.5 35.66,26.52 35.66,27.33 R4.1 | v23.88,9.55 v30.68,9.55
  Bottom 0.254: v34.65,24.69 34.65,23.27 39.22,18.69 39.22,18.09 v30.68,9.55 | v23.88,9.55 24.08,9.55 24.69,8.94 25.3,8.94 U1.P$21
N$27
  Bottom 0.254: GREEN1.C 1.32,27.94 2.95,26.31 3.56,26.31 5.08,24.79 R23.2
N$28  (via drill 0.3)
  Top 0.254: v2.74,22.35 5.18,22.35 6.1,23.27 8.84,23.27 9.14,22.96 v10.87,22.96 | v16.56,25.6 17.78,25.6 R22.2
  Bottom 0.254: v2.74,22.35 1.52,23.57 1.52,24.28 0.81,24.99 0.81,25.3 RED1.C | v10.87,22.96 10.87,23.27 13.21,25.6 v16.56,25.6
N$29  (via drill 0.3)
  Top 0.254: v14.43,26.82 17.58,23.67 17.78,23.67 R22.1
  Bottom 0.254: v14.43,26.82 8.43,32.82 7.52,32.82 7.21,32.51 7.21,26.42 7.52,26.11 7.52,22.25 5.89,20.62 4.37,20.62 3.56,19.81 3.56,18.19 IC2.7
N$30  (via drill 0.3)
  Top 0.254: v9.35,16.15 9.35,17.37 7.11,19.61 7.11,21.95 v6.4,22.66
  Bottom 0.254: v9.35,16.15 5.59,16.15 4.78,16.97 3.25,16.97 2.85,17.37 2.85,17.48 2.23,18.09 IC2.6 | v6.4,22.66 5.38,22.66 5.18,22.86 R23.1
N$31
  Bottom 0.254: IC2.2 3.56,12.7 3.56,12.9 4.27,13.61 6.5,13.61 7.32,12.8 R30.2
N$33
  Top 0.254: T7.1 32.11,22.86 32.11,20.93 32,20.83 R26.2
N$34
  Top 0.254: T7.3 33.02,25.09 33.02,29.97 32.61,30.38 BUZZER.P$1
USB-D+  (via drill 0.3)
  Top 0.254: v45.31,19.3 45.31,20.32 45.11,20.52 U$5.5
  Bottom 0.254: v45.31,19.3 46.43,18.19 46.43,17.48 45.41,16.46 44.5,16.46 ISP2.D+
USB-D-  (via drill 0.3)
  Top 0.254: v45.82,17.78 45.82,18.9 46.23,19.3 46.23,20.52 U$5.6
  Bottom 0.254: v45.82,17.78 45.11,17.07 44.5,17.07 ISP2.D-
V-IN  (via drill 0.3)
  Top 0.254: v3.66,4.88 5.79,4.88 10.36,9.45 v10.36,11.48 | v7.82,32.21 8.33,32.72 8.94,32.72 C3.1 | v8.13,23.88 v6.91,23.88
  Bottom 0.254: 7.01,23.88 7.01,24.79 3.86,27.94 GREEN1.A | 7.01,23.88 7.01,22.35 6.5,21.84 4.37,21.84 4.06,22.15 4.06,23.98 2.95,25.09 2.95,25.3 RED1.A | v3.66,4.88 3.66,6.3 2.74,7.21 2.23,7.21 0.71,8.74 0.71,11.38 0.91,11.58 0.91,12.6 IC2.4 | v10.36,11.48 10.36,11.79 9.75,12.39 9.75,15.65 9.96,15.85 9.96,18.59 9.65,18.9 7.21,18.9 6.1,20.02 | 6.1,20.02 4.37,20.02 4.06,19.71 4.06,19 4.67,18.39 4.67,18.19 IC2.8 4.88,18.19 5.79,17.27 6.3,17.27 R29.2 | v7.82,32.21 7.82,26.42 7.92,26.31 7.92,23.88 | 7.92,23.88 7.92,21.95 6.1,20.12 6.1,20.02 | v6.91,23.88 7.01,23.88 | v8.13,23.88 7.92,23.88
V-OUT  (via drill 0.3)
  Top 0.254: U$6.+VE 46.94,9.96 v44.6,7.62 44.6,4.37 41.86,1.63 4.37,1.63 2.54,3.45 2.03,3.45 1.52,3.96 v1.52,5.08 | v1.63,17.07 1.93,16.76 2.03,16.76 2.23,16.56 2.23,12.29 1.12,11.18 1.12,7.62 2.34,6.4 SWITCH1.2
  Bottom 0.254: v44.6,7.62 44.3,7.32 44.3,6.4 C14.1 | v1.63,17.07 1.02,17.68 1.02,18.09 IC2.5 | v1.52,5.08 1.52,5.49 2.34,6.3 SWITCH1.2